# EAGLE board Sensor Acquisition Board Rev5 (EAGLE 9.6.2)
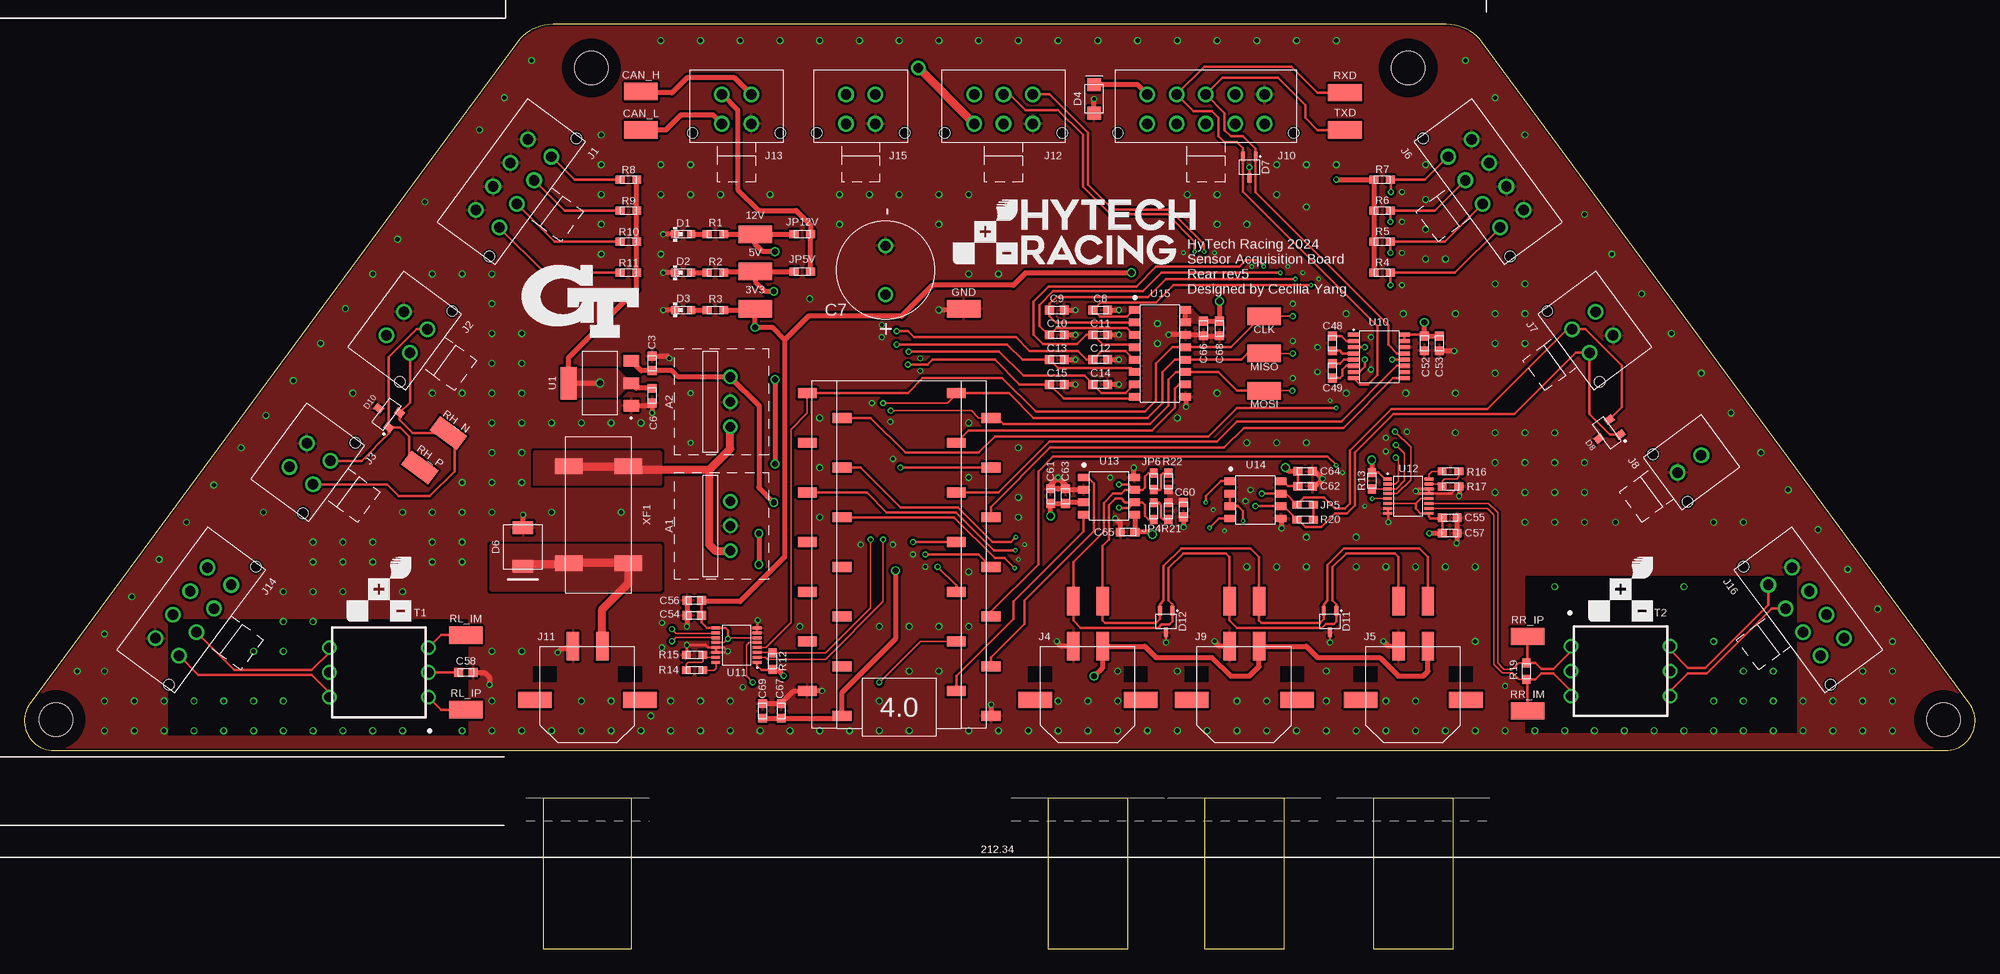
[diagram p5: board, top side]
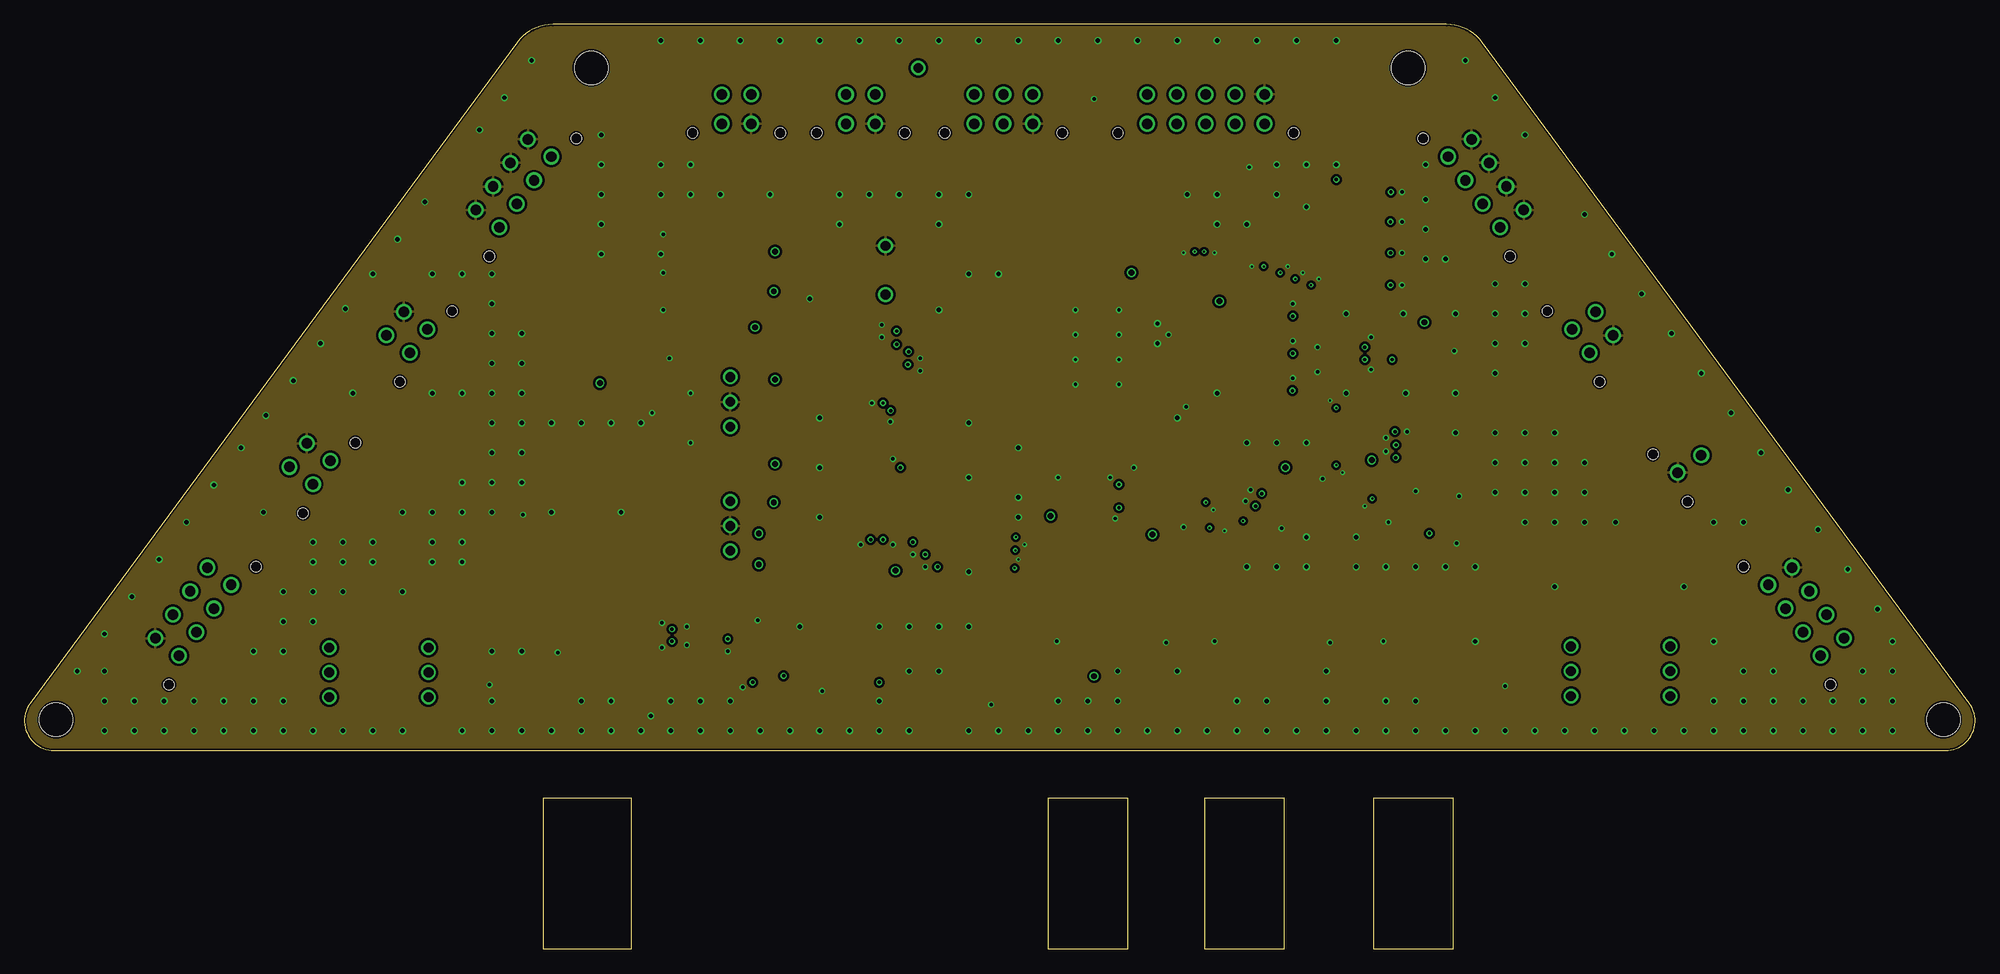
[diagram p6: board, inner layer Route2]
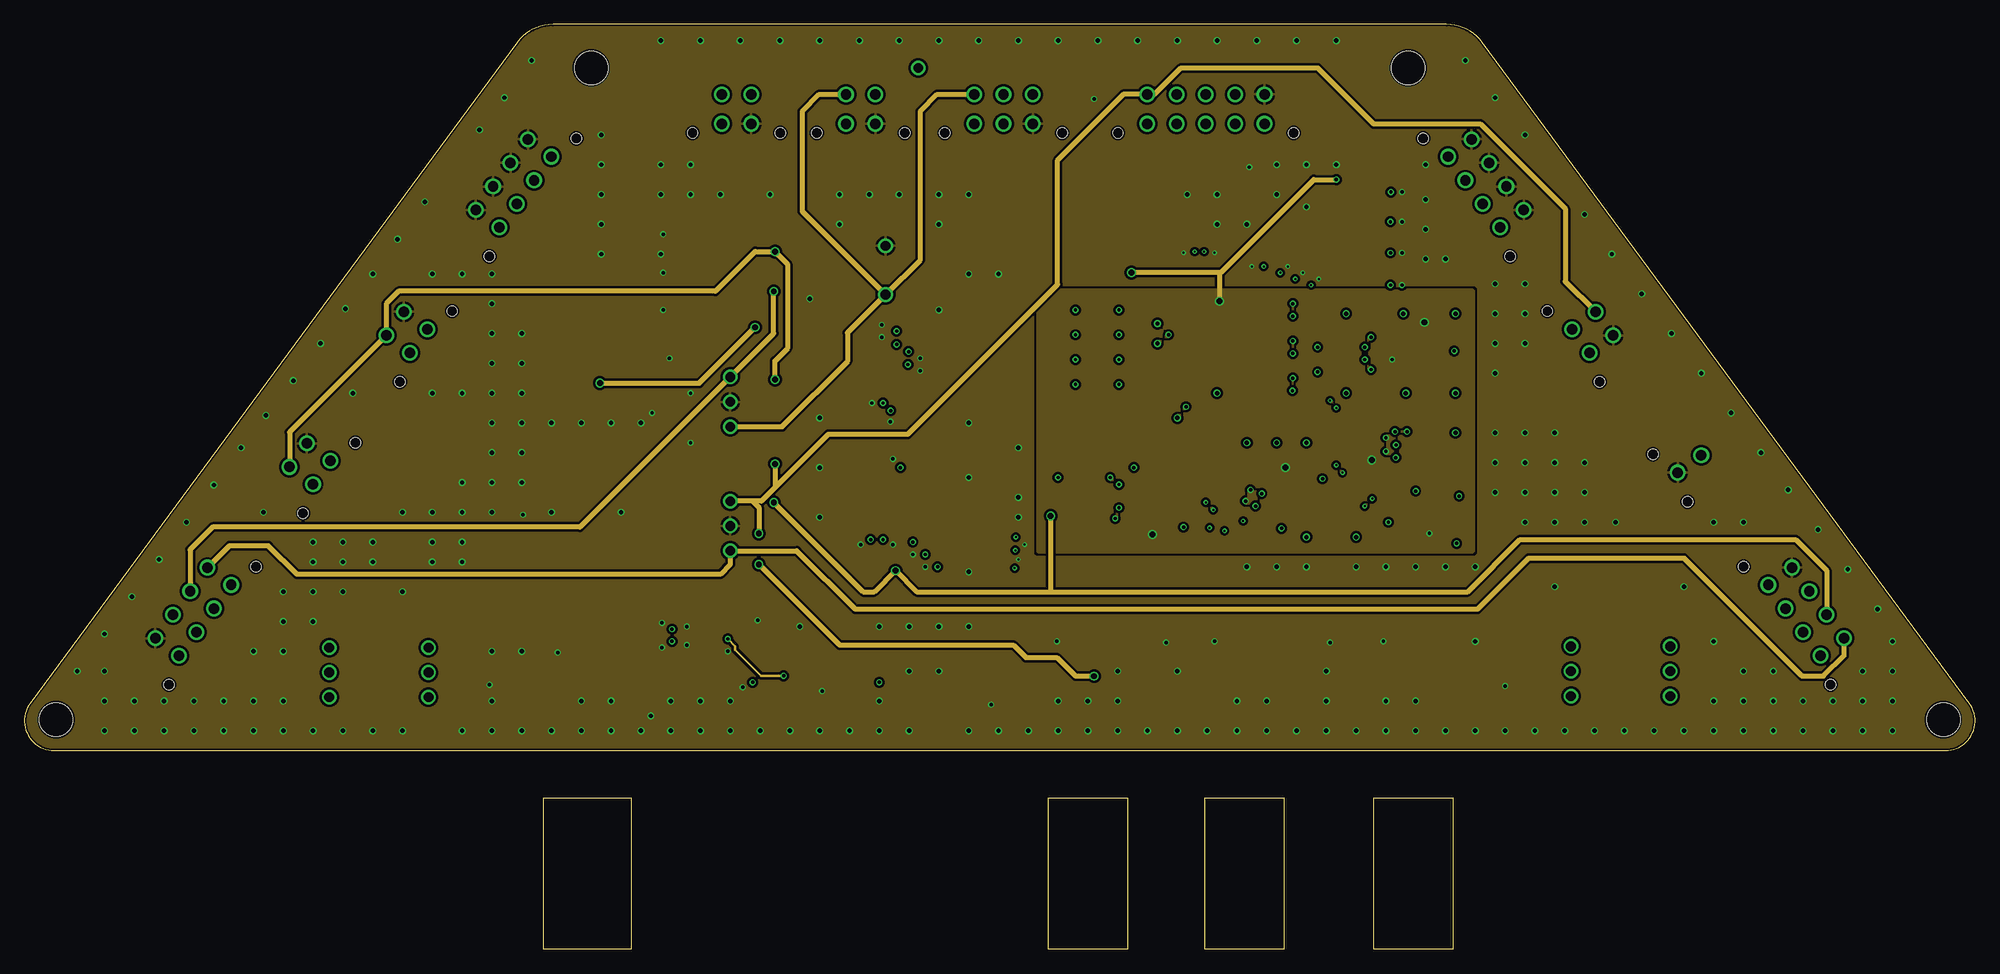
[diagram p7: board, inner layer Route15]
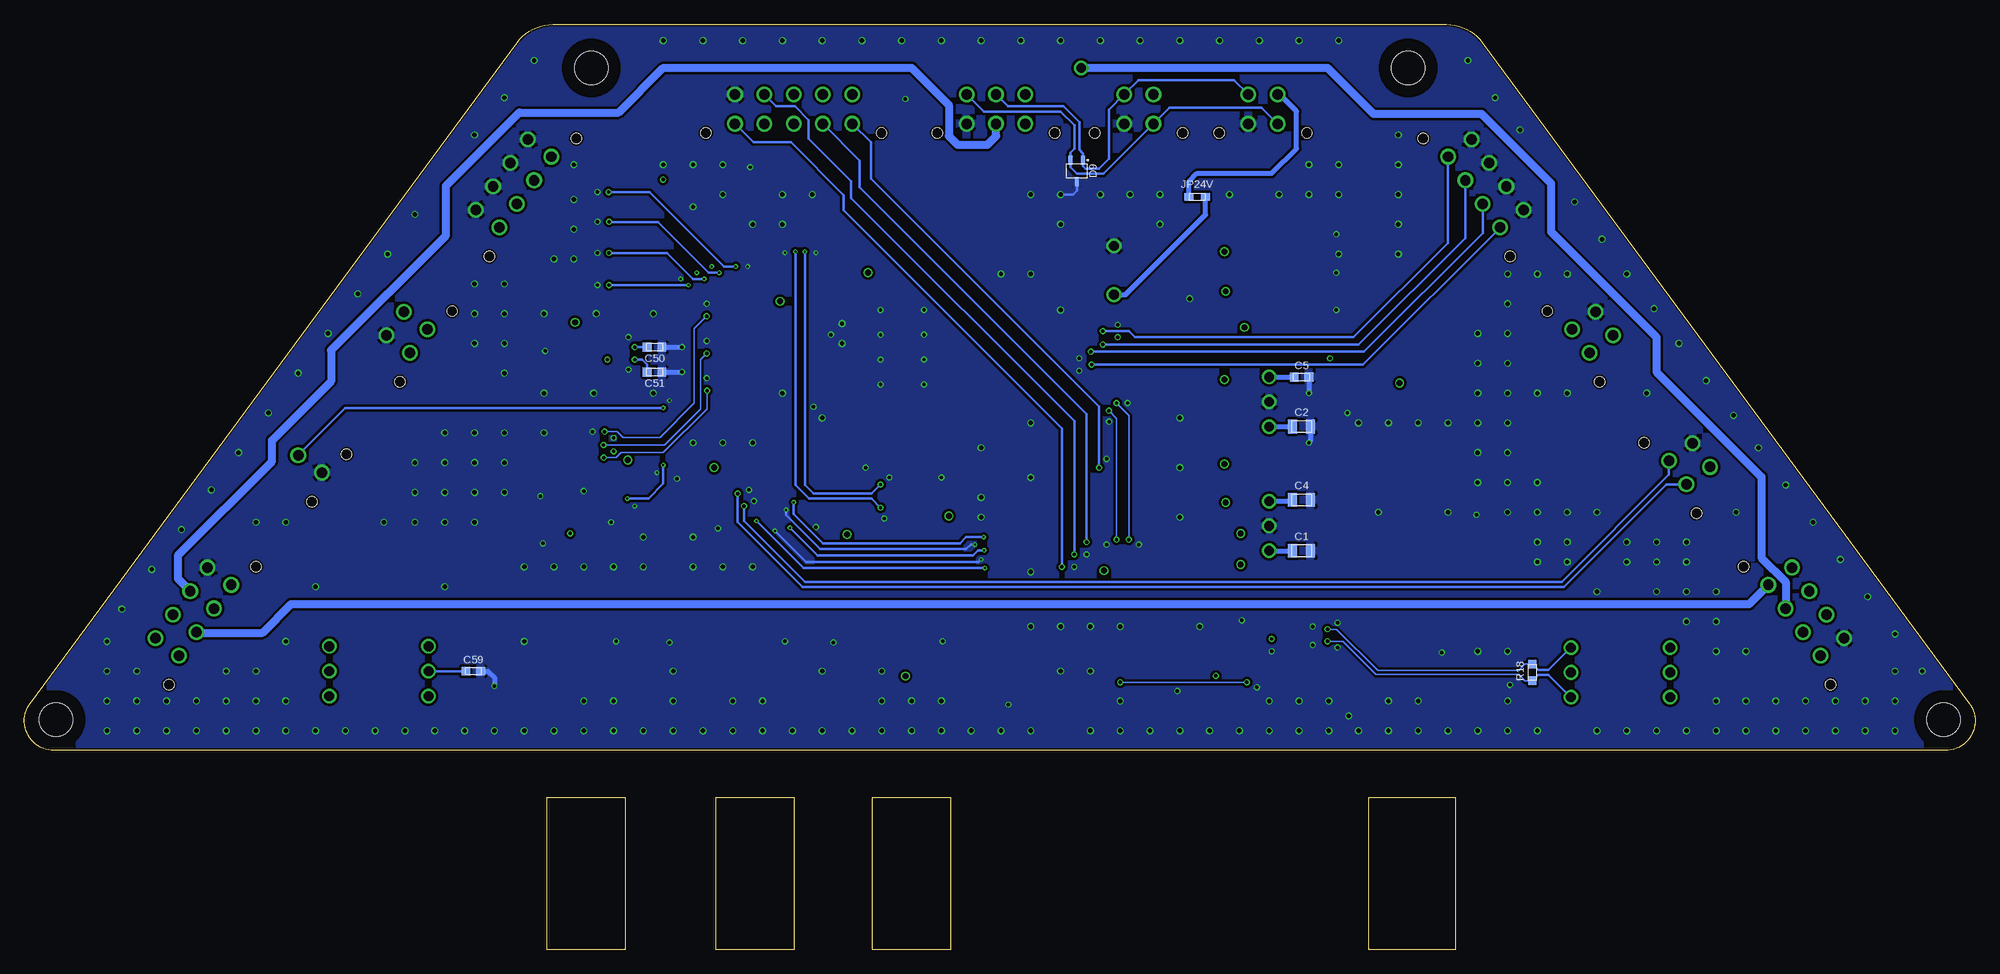
[diagram p8: board, bottom side, seen from below]

Size 199.51 x 74.3 mm. Coordinates in mm from the lower left corner, seen from the top.
Outline: 198.92,4.86 149.13,72.44 arc54 145.45,74.3 54.06,74.3 arc54 50.38,72.44 0.59,4.86 arc126 3.05,0 196.47,0 arc126 198.92,4.86
Copper layers (1+2*15+16): Top 0.035mm / dielectric 0.2mm / Route2 0.0175mm / dielectric 1.065mm / Route15 0.0175mm / dielectric 0.2mm / Bottom 0.035mm
Design rules "JLCPCB (4 Layer) *": minimum track width 5mil, minimum drill 0.2mm, track to track 10mil, track to pad 5mil, pad to pad 5mil, via to via 20mil, smd to smd 5mil, copper to edge 0.2mm, drill to drill 21mil, minimum pad ring 6mil, minimum via ring 5mil, stop-mask expansion 2mil, vias tented up to drill 30mil, thermal gap 10mil

## Footprints (pad centres in the part's own frame; a part is rotated, then mirrored left to right if it is on the bottom)
5015 = smd 3.429 x 1.778: 1 0,0
OKI-78SR = drill 0.991: 1 -2.54,0; 2 0,0; 3 2.54,0
TEENSY_SHORT_SSM = smd 1.905 x 1.02: 3.3V -5.842,-11.43; AGND/GND -9.398,-13.97; D0 5.842,-13.97; D1 9.398,-11.43; D2 5.842,-8.89; D3 9.398,-6.35; D4 5.842,-3.81; D5 9.398,-1.27; D6 5.842,1.27; D7 9.398,3.81; D8 5.842,6.35; D9 9.398,8.89; D10 5.842,11.43; D11 9.398,13.97; D12 5.842,16.51; D13 -9.398,16.51; D14 -5.842,13.97; D15 -9.398,11.43; D16 -5.842,8.89; D17 -9.398,6.35; D18 -5.842,3.81; D19 -9.398,1.27; D20 -5.842,-1.27; D21 -9.398,-3.81; D22 -5.842,-6.35; D23 -9.398,-8.89; GND 9.398,-16.51; VIN -5.842,-16.51
0805-CAP = smd 0.95 x 1.4: 1 -0.925,0; 2 0.925,0
0603-CAP = smd 0.9 x 0.9: 1 -0.75,0; 2 0.75,0
EEH-AZS = drill 1: MINUS 2.5,0; PLUS -2.5,0
0603-LED = smd 0.8 x 0.8: 1 -0.825,0; 2 0.825,0
SMF = smd 1.3 x 1.4: P$1 -1.45,0; P$2 1.45,0
1.5SMBJ = smd 1.27 x 2.1: 1 -1.98,0; 2 1.98,0
SC-70-3 = smd 0.95 x 0.4: 1 -1.1,0.65; 2 -1.1,-0.65; 3 1.1,0
SOT-23 = smd 0.711 x 0.889: 1 -0.94,-1.003; 2 0.94,-1.003; 3 0,1.003
MOLEX_MICROFIT_PTH_VERTICAL_08_DUAL = drill 1.067: 1 4.496,-2.997; 2 1.499,-2.997; 3 -1.499,-2.997; 4 -4.496,-2.997; 5 4.496,0; 6 1.499,0; 7 -1.499,0; 8 -4.496,0 | hole 1.067: 7.493,0.94; -7.493,0.94
MOLEX_MICROFIT_PTH_VERTICAL_04_DUAL = drill 1.067: 1 1.499,-2.997; 2 -1.499,-2.997; 3 1.499,0; 4 -1.499,0 | hole 1.067: 4.496,0.94; -4.496,0.94
MOLEX_MICROFIT_SMD_RIGHTANGLE_04_DUAL = smd 1.27 x 2.921: 1 1.5,5.474; 2 -1.5,5.474; 3 1.5,10.097; 4 -1.5,10.097 | smd 3.429 x 1.651: PAD1 5.386,0; PAD2 -5.386,0
MOLEX_MICROFIT_PTH_VERTICAL_02_DUAL = drill 1.067: 1 0,-2.997; 2 0,0 | hole 1.067: 2.997,0.94; -2.997,0.94
MOLEX_MICROFIT_PTH_VERTICAL_10_DUAL = drill 1.067: 1 5.994,-2.997; 2 2.997,-2.997; 3 0,-2.997; 4 -2.997,-2.997; 5 -5.994,-2.997; 6 5.994,0; 7 2.997,0; 8 0,0; 9 -2.997,0; 10 -5.994,0 | hole 1.067: 8.992,0.94; -8.992,0.94
MOLEX_MICROFIT_SMD_RIGHTANGLE_02_SINGLE = smd 1.27 x 2.921: 1 1.499,5.474; 2 -1.499,5.474 | smd 3.429 x 1.651: PAD1 5.372,0; PAD2 -5.372,0
MOLEX_MICROFIT_PTH_VERTICAL_06_DUAL = drill 1.067: 1 2.997,-2.997; 2 0,-2.997; 3 -2.997,-2.997; 4 2.997,0; 5 0,0; 6 -2.997,0 | hole 1.067: 5.994,0.94; -5.994,0.94
0603-RES = smd 0.9 x 0.8: 1 -0.85,0; 2 0.85,0
78613/3C = drill 0.991 pad 1.2: 1 -5.08,2.54; 2 -5.08,0; 3 -5.08,-2.54; 4 5.08,-2.54; 5 5.08,0; 6 5.08,2.54
SOT-223 = smd 1.2 x 1.6: 1 -2.3,-3.2; 2 0,-3.2; 3 2.3,-3.2 | smd 3.3 x 1.6: 4 0,3.2
SSOP-16 = smd 0.419 x 1.143: 1 -2.159,-2.54; 2 -1.524,-2.54; 3 -0.889,-2.54; 4 -0.254,-2.54; 5 0.381,-2.54; 6 1.016,-2.54; 7 1.651,-2.54; 8 2.286,-2.54; 9 2.286,2.667; 10 1.651,2.667; 11 1.016,2.667; 12 0.381,2.667; 13 -0.254,2.667; 14 -0.889,2.667; 15 -1.524,2.667; 16 -2.159,2.667
MSOP-16 = smd 0.305 x 0.889: 1 -1.75,-2.106; 2 -1.25,-2.106; 3 -0.75,-2.106; 4 -0.25,-2.106; 5 0.25,-2.106; 6 0.75,-2.106; 7 1.25,-2.106; 8 1.75,-2.106; 9 1.75,2.106; 10 1.25,2.106; 11 0.75,2.106; 12 0.25,2.106; 13 -0.25,2.106; 14 -0.75,2.106; 15 -1.25,2.106; 16 -1.75,2.106
SOIC-08(NARROW,0.15") = smd 0.762 x 1.143: 1 -1.905,-2.603; 2 -0.635,-2.603; 3 0.635,-2.603; 4 1.905,-2.603; 5 1.905,2.603; 6 0.635,2.603; 7 -0.635,2.603; 8 -1.905,2.603
SOIC-16 = smd 0.762 x 1.143: 1 -4.445,-2.603; 2 -3.175,-2.603; 3 -1.905,-2.603; 4 -0.635,-2.603; 5 0.635,-2.603; 6 1.905,-2.603; 7 3.175,-2.603; 8 4.445,-2.603; 9 4.445,2.603; 10 3.175,2.603; 11 1.905,2.603; 12 0.635,2.603; 13 -0.635,2.603; 14 -1.905,2.603; 15 -3.175,2.603; 16 -4.445,2.603
MOUNTING_M3 = hole 3.4: 0,0
3588 = smd 1.575 x 2.819: 1 -4.953,3.035; 2 -4.953,-3.035; 3 4.953,-3.035; 4 4.953,3.035

## Placement (x,y rotation side)
3V3  TEST_POINT  [5015]  74.74,45.21 180 top
5V  TEST_POINT  [5015]  74.74,49.02 180 top
12V  TEST_POINT  [5015]  74.74,52.83 180 top
A1  VOLTAGE_REGULATOR_MODULE_OKI-78SR_12V  [OKI-78SR]  72.2,22.99 90 top
A2  VOLTAGE_REGULATOR_MODULE_OKI-78SR_5V  [OKI-78SR]  72.2,35.69 90 top
A3  TEENSY_4.0SM  [TEENSY_SHORT_SSM]  89.47,20.07 0 top
C1  CAPACITOR_0805_50V_10UF  [0805-CAP]  68.9,20.45 0 bottom
C2  CAPACITOR_0805_50V_10UF  [0805-CAP]  68.9,33.15 0 bottom
C3  CAPACITOR_0603_25V_10UF  [0603-CAP]  64.2,39.62 90 top
C4  CAPACITOR_0805_50V_10UF  [0805-CAP]  68.9,25.65 0 bottom
C5  CAPACITOR_0603_25V_10UF  [0603-CAP]  68.9,38.23 0 bottom
C6  CAPACITOR_0603_25V_10UF  [0603-CAP]  64.2,36.32 270 top
C7  CAPACITOR_ELECTROLYTIC_EEH_AZS_470UF  [EEH-AZS]  88.07,49.15 90 top
C8  CAPACITOR_0603_10V_1UF  [0603-CAP]  110.04,45.09 0 top
C9  CAPACITOR_0603_10V_1UF  [0603-CAP]  105.6,45.09 0 top
C10  CAPACITOR_0603_10V_1UF  [0603-CAP]  105.6,42.55 0 top
C11  CAPACITOR_0603_10V_1UF  [0603-CAP]  110.04,42.55 0 top
C12  CAPACITOR_0603_10V_1UF  [0603-CAP]  110.04,40.01 0 top
C13  CAPACITOR_0603_10V_1UF  [0603-CAP]  105.6,40.01 0 top
C14  CAPACITOR_0603_10V_1UF  [0603-CAP]  110.04,37.47 0 top
C15  CAPACITOR_0603_10V_1UF  [0603-CAP]  105.6,37.47 0 top
C48  CAPACITOR_0603_35V_0.1UF  [0603-CAP]  133.79,41.66 270 top
C49  CAPACITOR_0603_35V_0.1UF  [0603-CAP]  133.79,38.86 270 top
C50  CAPACITOR_0603_35V_0.1UF  [0603-CAP]  135.06,41.27 180 bottom
C51  CAPACITOR_0603_35V_0.1UF  [0603-CAP]  135.06,38.73 180 bottom
C52  CAPACITOR_0603_35V_0.1UF  [0603-CAP]  143.19,41.66 270 top
C53  CAPACITOR_0603_35V_1UF  [0603-CAP]  144.72,41.66 270 top
C54  CAPACITOR_0603_10V_0.1UF  [0603-CAP]  68.52,13.84 180 top
C55  CAPACITOR_0603_10V_0.1UF  [0603-CAP]  145.78,23.83 0 top
C56  CAPACITOR_0603_10V_1UF  [0603-CAP]  68.52,15.37 180 top
C57  CAPACITOR_0603_10V_1UF  [0603-CAP]  145.78,22.25 0 top
C58  CAPACITOR_0603_10V_15PF  [0603-CAP]  45.15,8 0 top
C59  CAPACITOR_0603_10V_15PF  [0603-CAP]  153.61,8.13 0 bottom
C60  CAPACITOR_0603_10V_4.7NF  [0603-CAP]  118.55,24.64 270 top
C61  CAPACITOR_0603_10V_4.7UF  [0603-CAP]  104.96,26.04 90 top
C62  CAPACITOR_0603_35V_0.1UF  [0603-CAP]  131,27.05 0 top
C63  CAPACITOR_0603_10V_0.1UF  [0603-CAP]  106.49,26.04 90 top
C64  CAPACITOR_0603_35V_1UF  [0603-CAP]  131,28.57 0 top
C65  CAPACITOR_0603_10V_0.1UF  [0603-CAP]  112.84,22.35 180 top
C66  CAPACITOR_0603_10V_0.1UF  [0603-CAP]  120.59,43.18 270 top
C67  CAPACITOR_0603_10V_0.1UF  [0603-CAP]  77.41,4.06 90 top
C68  CAPACITOR_0603_10V_1UF  [0603-CAP]  122.24,43.18 270 top
C69  CAPACITOR_0603_10V_1UF  [0603-CAP]  75.5,4.06 90 top
CAN_H  TEST_POINT  [5015]  63.05,67.44 0 top
CAN_L  TEST_POINT  [5015]  63.05,63.5 0 top
CLK  TEST_POINT  [5015]  126.81,44.45 0 top
D1  LED_0603_RED  [0603-LED]  67.37,52.83 0 top
D2  LED_0603_YELLOW  [0603-LED]  67.37,48.9 0 top
D3  LED_0603_GREEN  [0603-LED]  67.37,45.09 0 top
D4  TVS_DO-219AB_14V  [SMF]  109.41,66.67 90 top
D6  TVS_DO-214AA_30V  [1.5SMBJ]  50.99,20.83 270 top
D7  TVS_BIDIRECTIONAL_DUAL  [SC-70-3]  125.28,59.69 270 top
D8  TVS_BIDIRECTIONAL_DUALRS422  [SOT-23]  161.86,32.51 126.4 top
D9  TVS_BIDIRECTIONAL_DUAL  [SC-70-3]  91.88,59.31 270 bottom
D10  TVS_BIDIRECTIONAL_DUALRS422  [SOT-23]  37.02,34.42 53.6 top
D11  TVS_BIDIRECTIONAL_DUAL  [SC-70-3]  133.54,13.21 270 top
D12  TVS_BIDIRECTIONAL_DUAL  [SC-70-3]  116.78,13.21 270 top
GND  TEST_POINT  [5015]  96.07,45.21 0 top
J1  CONNECTOR-8_μF_T_V_BLACK  [MOLEX_MICROFIT_PTH_VERTICAL_08_DUAL]  51.24,57.15 233.6 top
J2  CONNECTOR-4_μF_T_V_BLACK  [MOLEX_MICROFIT_PTH_VERTICAL_04_DUAL]  40.32,41.91 233.6 top
J3  CONNECTOR-4_μF_T_V_BLACK  [MOLEX_MICROFIT_PTH_VERTICAL_04_DUAL]  30.42,28.45 233.6 top
J4  CONNECTOR-4_μF_S_RA_  [MOLEX_MICROFIT_SMD_RIGHTANGLE_04_DUAL]  108.77,5.21 0 top
J5  CONNECTOR-4_μF_S_RA_  [MOLEX_MICROFIT_SMD_RIGHTANGLE_04_DUAL]  142.05,5.21 0 top
J6  CONNECTOR-8_μF_T_V_BLACK  [MOLEX_MICROFIT_PTH_VERTICAL_08_DUAL]  148.27,57.15 126.4 top
J7  CONNECTOR-4_μF_T_V_BLACK  [MOLEX_MICROFIT_PTH_VERTICAL_04_DUAL]  159.19,41.91 126.4 top
J8  CONNECTOR-2_μF_T_V_BLACK  [MOLEX_MICROFIT_PTH_VERTICAL_02_DUAL]  169.1,28.45 126.4 top
J9  CONNECTOR-4_μF_S_RA_  [MOLEX_MICROFIT_SMD_RIGHTANGLE_04_DUAL]  124.78,5.21 0 top
J10  CONNECTOR-10_MF_T_V_  [MOLEX_MICROFIT_PTH_VERTICAL_10_DUAL]  120.84,64.14 180 top
J11  CONNECTOR-2_MICROFIT_SMD_RIGHTANGLE_02_SINGLE_BLACK  [MOLEX_MICROFIT_SMD_RIGHTANGLE_02_SINGLE]  57.59,5.21 0 top
J12  CONNECTOR-6_μF_T_V_BLACK  [MOLEX_MICROFIT_PTH_VERTICAL_06_DUAL]  100.14,64.14 180 top
J13  CONNECTOR-4_μF_T_V_BLACK  [MOLEX_MICROFIT_PTH_VERTICAL_04_DUAL]  72.83,64.14 180 top
J14  CONNECTOR-8_μF_T_V_BLACK  [MOLEX_MICROFIT_PTH_VERTICAL_08_DUAL]  18.48,13.34 233.6 top
J15  CONNECTOR-4_μF_T_V_BLACK  [MOLEX_MICROFIT_PTH_VERTICAL_04_DUAL]  85.53,64.14 180 top
J16  CONNECTOR-8_μF_T_V_BLACK  [MOLEX_MICROFIT_PTH_VERTICAL_08_DUAL]  181.04,13.34 126.4 top
JP4  JUMPER_0603_  [0603-RES]  115.51,24.51 90 top
JP5  JUMPER_0603_  [0603-RES]  131,25.15 180 top
JP5V  JUMPER_0603_  [0603-RES]  79.56,49.02 180 top
JP6  JUMPER_0603_  [0603-RES]  115.51,27.56 90 top
JP12V  JUMPER_0603_  [0603-RES]  79.56,52.83 180 top
JP24V  JUMPER_0603_  [0603-RES]  79.56,56.64 0 bottom
MISO  TEST_POINT  [5015]  126.81,40.64 0 top
MOSI  TEST_POINT  [5015]  126.81,36.83 0 top
R1  RESISTOR_0603_1K  [0603-RES]  70.67,52.83 180 top
R2  RESISTOR_0603_240  [0603-RES]  70.67,48.9 180 top
R3  RESISTOR_0603_120  [0603-RES]  70.67,45.09 180 top
R4  RESISTOR_0603_8.35K  [0603-RES]  138.87,48.9 0 top
R5  RESISTOR_0603_8.35K  [0603-RES]  138.87,52.07 0 top
R6  RESISTOR_0603_8.35K  [0603-RES]  138.87,55.24 0 top
R7  RESISTOR_0603_8.35K  [0603-RES]  138.87,58.42 0 top
R8  RESISTOR_0603_8.35K  [0603-RES]  61.78,58.42 180 top
R9  RESISTOR_0603_8.35K  [0603-RES]  61.78,55.24 180 top
R10  RESISTOR_0603_8.35K  [0603-RES]  61.78,52.07 180 top
R11  RESISTOR_0603_8.35K  [0603-RES]  61.78,48.9 180 top
R12  RESISTOR_0603_2K  [0603-RES]  76.52,9.14 270 top
R13  RESISTOR_0603_2K  [0603-RES]  137.81,27.61 90 top
R14  RESISTOR_0603_1.33K  [0603-RES]  68.54,8.23 0 top
R15  RESISTOR_0603_1.13K  [0603-RES]  68.54,9.78 0 top
R16  RESISTOR_0603_1.33K  [0603-RES]  145.86,28.57 180 top
R17  RESISTOR_0603_1.13K  [0603-RES]  145.86,27.03 180 top
R18  RESISTOR_0603_120  [0603-RES]  45.27,8 270 bottom
R19  RESISTOR_0603_120  [0603-RES]  153.61,8.13 90 top
R20  RESISTOR_0603_120  [0603-RES]  131,23.62 0 top
R21  RESISTOR_0603_60.4  [0603-RES]  117.03,24.51 90 top
R22  RESISTOR_0603_60.4  [0603-RES]  117.03,27.56 90 top
RH_N  TEST_POINT  [5015]  43.37,32.51 143.6 top
RH_P  TEST_POINT  [5015]  40.45,28.96 143.6 top
RL_IM  TEST_POINT  [5015]  45.15,11.81 0 top
RL_IP  TEST_POINT  [5015]  45.15,4.19 0 top
RR_IM  TEST_POINT  [5015]  153.73,4.06 0 top
RR_IP  TEST_POINT  [5015]  153.73,11.68 0 top
RXD  TEST_POINT  [5015]  135.06,67.31 180 top
T1  78613/3C_78613/3C  [78613/3C]  36.26,8 180 top
T2  78613/3C_78613/3C  [78613/3C]  163.26,8.13 0 top
TXD  TEST_POINT  [5015]  135.06,63.5 180 top
U1  VOLTAGE_REGULATOR_SOT-223_3.3V  [SOT-223]  58.86,37.59 90 top
U10  MAX3227  [SSOP-16]  138.49,40.39 270 top
U11  LTC6820  [MSOP-16]  72.83,10.79 90 top
U12  LTC6820  [MSOP-16]  141.54,26.04 270 top
U13  TCAN1051HQV-Q1  [SOIC-08(NARROW,0.15")]  110.93,26.04 270 top
U14  MAX3075  [SOIC-08(NARROW,0.15")]  125.92,25.65 270 top
U15  MCP3208  [SOIC-16]  116.14,40.64 270 top
U$1  [LOGO_HYTECH_MEDIUM]  94.93,49.78 0 top
U$2  [LOGO_GT_MEDIUM]  56.83,45.97 0 top
U$3  [MOUNTING_M3]  141.54,69.85 0 top
U$4  [MOUNTING_M3]  57.97,69.85 0 top
U$5  [MOUNTING_M3]  196.28,3.17 0 top
U$6  [MOUNTING_M3]  3.24,3.17 0 top
U$7  [LOGO_HYTECH_SQUARE_LARGE]  36.26,16.51 0 top
U$8  [LOGO_HYTECH_SQUARE_LARGE]  163.26,16.51 0 top
XF1  FUSE_HOLDER_MINIBLADESMD  [3588]  58.74,24.13 90 top

## Tracks (layer width: path | path; a pad name or v marks a point on that pad's centre or on a via)
24VIN
  Top 0.813: J11.1 59.09,14.45 61.77,17.13 XF1.2 XF1.1 55.57,19.05 51.19,19.05 D6.2
  pour Top (no thermals): 47.81,20.95 64.96,20.95 64.96,16.51 47.81,16.51
!ADC1_CS  (via drill 0.35)
  Top 0.152: v74.48,6.99 73.85,7.62 73.85,10.79 74.1,11.04 U11.5 | A3.D2 91.63,11.18 v87.44,6.99
  Bottom 0.152: v74.48,6.99 v87.44,6.99
!ADC2_CS  (via drill 0.2)
  Top 0.152: U12.5 v137.86,25.79 v137.86,25.78
  Top 0.254: v134.17,29.21 133.29,30.1 105.22,30.1 103.69,28.57 103.69,19.05 98.87,14.22 A3.D3
  Bottom 0.254: v137.86,25.78 135.7,25.78 134.17,27.3 v134.17,29.21
!ADC3_CS
  Top 0.254: U15.10 118.11,37.47 117.66,37.02 117.66,35.1 115.33,32.77 97.34,32.77 96.58,32.77 A3.D10
+3V3  (via drill 0.35, 0.6)
  Top 0.152: U11.12 71.56,11.04 v71.94,11.43 | U11.6 72.06,11.54 | U12.6 142.31,25.29 142.81,25.79 U12.12
  Top 0.254: U13.5 113.59,24.08 | U10.15 U10.16 143.08,42.55 C52.1 | 143.95,42.42 C52.1 | C52.1 | R13.2 138.48,28.46 139.16,27.79 U12.1 | 72.06,11.54 v71.94,11.43 71.94,12.32 71.72,12.54 U11.9 69.81,12.54 69.27,13.09 C54.1 69.27,15.24 C56.1 | 74.61,45.09 3V3.1 | U14.8 128.71,27.56 129.22,27.05 C62.1 | 130.25,28.39 C64.1 C62.1 | 130.25,27.24 C62.1 | C57.1 C55.1 144.96,23.75 143.83,23.75 143.65,23.93 U12.9 143.63,24.27 142.8,24.27 142.31,24.75 142.31,25.29 | R12.2 76.48,8.26 75.37,8.26 74.94,8.69 U11.1 | U10.12 v139.89,40.01
  Top 0.508: 113.59,24.08 C65.1 115.12,22.35 v115.38,22.1 | C6.1 62.58,37.07 U1.2 | C53.1 C52.1 v143.19,43.81 | v58.86,37.59 U1.4 55.66,40.23 62.63,47.2 R11.1 R10.1 R9.1 R8.1 | 137.73,28.54 R13.2 v137.81,29.72 | R3.1 74.61,45.09 | 120.47,43.81 C66.1 C68.1 v122.24,45.97 | U15.15 U15.16 | v113.22,48.9 102.42,48.9 101.15,47.62 92.9,47.62 89.72,44.45 80.2,44.45 77.77,42.02 | 77.77,42.02 77.77,19.79 73.21,15.24 69.27,15.24 | 3V3.1 v74.74,43.31 76.48,43.31 77.77,42.02 | C64.1 129.35,28.57 v128.97,28.96 | C57.1 145.01,22.23 v143.7,22.23 | v134.17,58.42 R7.1 R6.1 R5.1 R4.1 | R12.2 77.02,8.29 v77.66,7.66
  Route15 0.254: v71.94,11.43 72.71,10.67 72.71,10.29 75.33,7.66 v77.66,7.66
  Route15 0.508: v58.86,37.59 69.02,37.59 v74.74,43.31 | v134.17,58.42 131.89,58.42 122.36,48.9 122.24,48.9 | 122.24,48.9 v113.22,48.9 | 122.24,48.9 v122.24,45.97
  pour Top (isolate 0.254, no thermals): 55.43,38.86 60.51,38.86 61.78,37.59 60.51,36.32 55.43,36.32
  pour Top (no thermals): 120.71,43.81 118.68,43.81 118.68,45.09 119.44,45.09
  pour Route15: 103.69,20.45 148.14,20.45 148.14,46.99 103.69,46.99
+5V  (via drill 0.6)
  Top 0.254: 106.6,25.4 C63.1 | R2.1 71.65,49.02
  Top 0.508: U1.3 63.08,38.87 C3.1 66.22,38.87 66.86,38.23 A2.3 75.12,35.31 75.12,26.92 v76.64,25.4 | U13.3 106.6,25.4 | C69.1 C67.1 83.39,3.31 A3.VIN 83.63,5.97 89.09,11.43 v89.09,18.41 | v104.96,24.02 C61.1 C63.1 | 5V.1 JP5V.2 | 71.65,49.02 5V.1 | 5V.1 74.74,48.01 75.75,46.99 v76.64,46.99
  Route15 0.508: v76.64,25.4 85.79,16.26 86.93,16.26 v89.09,18.41 91.25,16.26 104.96,16.26 | 104.96,16.26 147.64,16.26 152.96,21.58 181.17,21.58 184.34,18.41 J16.3 | v76.64,46.99 76.64,42.67 A2.3 56.83,22.86 19.24,22.86 16.95,20.57 J14.3 | v104.96,24.02 104.96,16.26
  Bottom 0.508: A2.3 C5.1
+12V  (via drill 0.6)
  Top 0.508: 12V.1 JP12V.2 | v75.12,22.23 v75.12,19.05 | v109.41,7.62 110.27,8.48 J4.1 114.6,10.68 115.76,9.53 121.47,9.53 123.38,7.62 125.28,7.62 126.28,8.61 J9.1 131.11,10.68 132.27,9.53 138.62,9.53 140.52,7.62 143.06,7.62 143.57,8.13 143.57,10.66 J5.1 | J10.1 113.85,68.12 D4.P$2 | R1.1 12V.1 | v76.77,51.05 75.5,51.05 74.74,51.82 12V.1 | v76.77,37.97 v76.77,29.34
  Route15 0.508: 76.77,26.92 75.37,25.53 74.48,25.53 | 74.48,25.53 A1.3 | v76.77,37.97 76.77,39.88 78.04,41.15 78.04,49.78 v76.77,51.05 74.74,51.05 70.67,46.99 38.29,46.99 37.02,45.72 J2.1 27.11,32.58 J3.1 | 74.48,25.53 75.12,24.89 v75.12,22.23 | v75.12,19.05 83.37,10.79 101.15,10.79 102.42,9.53 105.6,9.53 107.5,7.62 v109.41,7.62 | J7.1 157.61,48.01 157.61,55.44 148.91,64.14 137.98,64.14 132.27,69.85 118.3,69.85 115.58,67.13 J10.1 112.41,67.13 105.66,60.39 105.66,47.69 90.36,32.38 82.23,32.38 76.77,26.92 | v76.77,29.34 76.77,26.92
  Bottom 0.508: A1.3 69.95,25.53 C4.1
+24V
  Top 0.508: XF1.3 62.15,28.7
  Top 0.813: XF1.4 XF1.3 | 70.04,28.7 62.15,28.7 | 70.04,28.7 72.2,30.86 A2.1 | A1.1 70.67,20.45 70.04,21.08 70.04,28.7
  Route15 0.508: A2.1 77.51,33.15 84.19,39.83 84.19,42.76 C7.PLUS | C7.PLUS 79.56,55.16 79.56,65.41 81.29,67.13 J15.1 | C7.PLUS 91.63,50.2 91.63,65.41 93.36,67.13 J12.1 | J14.4 20.96,20.95 24.95,20.95 27.88,18.03 71.18,18.03 72.2,19.05 A1.1 78.99,20.45 84.96,14.48 148.65,14.48 153.86,19.68 169.73,19.68 181.8,7.62 184,7.62 186.12,9.74 J16.4
  Bottom 0.508: A1.1 C1.1 | A2.1 C2.1 | C7.PLUS 86.89,46.65 78.71,54.83 JP24V.2
  pour Top (no thermals): 52.26,30.48 64.96,30.48 64.96,27.3 52.26,27.3
CAN_N  (via drill 0.2, 0.35)
  Top 0.254: U13.6 114.36,25.4 114.62,25.15 114.62,24 114.96,23.66 JP4.1 | J5.3 143.55,19.81 142.66,20.7 134.98,20.7 133.29,19.01 133.29,15.37 132.89,14.97 D11.2 132.9,14.29 132.9,13.46 132.52,13.08 126.53,13.08 126.28,13.34 J9.3 126.28,19.81 125.39,20.7 118.34,20.7 116.52,18.88 116.52,15.37 116.13,14.97 D12.2 116.13,13.45 115.76,13.08 110.53,13.08 110.27,13.34 J4.3 110.27,20.93 110.93,21.59 110.93,25.15 111.57,25.78 112.2,25.78 112.58,25.4 U13.6 | v120.66,51.05 120.66,51.83 117.11,55.37 111.31,55.37 108.77,57.91 108.77,63.2 104.84,67.13 J12.3 | v111.95,24.84 112.98,24.84 U13.6
  Top 0.508: J13.3 70.45,65.02 67.12,65.02 65.59,63.5 CAN_L.1
  Bottom 0.254: J12.3 101.38,65.38 93.53,65.38 92.14,63.98 92.14,61.59 92.53,61.2 D9.2 92.53,59.7 91.86,59.03 89.14,59.03 J15.3 82.38,65.79 72.99,65.79 J13.3 | v120.66,51.05 120.66,27.17 119.27,25.78 112.89,25.78 v111.95,24.84
CAN_P  (via drill 0.2, 0.35)
  Top 0.254: J5.4 140.55,19.81 140.17,20.19 135.19,20.19 133.79,18.8 133.79,15.37 134.19,14.97 D11.1 134.19,13.22 133.92,12.95 133.11,12.95 132.73,12.57 124.04,12.57 123.28,13.34 J9.4 123.28,19.81 122.9,20.19 118.55,20.19 117.03,18.67 117.03,15.37 117.43,14.97 D12.1 117.43,13.22 117.11,12.91 116.31,12.91 115.97,12.57 108.04,12.57 107.27,13.34 J4.4 107.27,19.3 107.29,19.3 110.43,22.44 110.43,25.36 111.36,26.29 112.2,26.29 112.58,26.67 U13.7 | v119.7,51.05 119.7,52.07 116.9,54.86 111.1,54.86 108.27,57.7 108.27,62.99 105.73,65.53 102.37,65.53 100.77,67.13 J12.2 | JP6.2 114.96,28.41 114.62,28.07 114.62,26.92 114.36,26.67 U13.7 | v111.95,27.23 112.98,27.23 U13.7
  Top 0.508: J13.2 72.63,68.83 67.75,68.83 66.23,67.31 63.18,67.31 CAN_H.1
  Bottom 0.254: J12.2 98.92,65.91 93.24,65.91 91.6,64.28 91.6,61.47 91.23,61.1 D9.1 91.25,60.39 91.25,59.82 90.99,59.56 89.62,59.56 88.61,60.58 88.61,65.56 J15.2 85.58,68.58 75.78,68.58 J13.2 | v119.7,51.05 119.7,27.18 118.81,26.29 112.89,26.29 v111.95,27.23
EN_485  (via drill 0.2)
  Top 0.254: U14.2 U14.3 124.14,25.02 124.65,24.51 v124.65,23.5 | A3.D18 95.06,23.88 99.25,19.68 100.27,19.68 v101.28,18.67
  Bottom 0.254: v101.28,18.67 119.82,18.67 v124.65,23.5
GND  (via drill 0.2, 0.35, 0.45)
  Top 0.254: 106.6,26.67 C63.2 | U12.7 U12.8 139.51,24.21 v139.51,23.37 | 67.75,9.78 R15.1 67.75,9.84 v67.75,10.79 69.66,10.79 69.91,10.54 U11.13 | R17.1 145.98,26.29 U12.13 U12.14 142.54,26.79 v142.3,26.54 142.56,26.29 U12.13 | U11.13 U11.14 71.83,10.04 v71.94,10.16 71.56,10.54 U11.13 | 67.77,12.71 v67.75,12.7 | v74.99,13.34 74.99,12.6 U11.8 U11.7 | D12.3 v116.78,11.05 | D11.3 v133.54,11.05 | D7.3 v125.28,59.69
  Top 0.508: C60.2 v118.55,22.86 | C6.2 | 55.98,10.79 J11.2 55.83,10.41 54.93,10.41 v54.55,10.03 | v81.6,6.1 A3.AGND/GND 78.69,6.1 C67.2 C69.2 | C58.2 47.05,8 47.56,7.49 v47.56,6.73 | 67.77,12.71 C54.2 C56.2 | D1.1 v65.34,52.83 | D2.1 v65.34,48.9 | D3.1 v65.34,45.09 | C3.2 65.73,40.37 v65.98,40.13 | C6.2 v64.2,34.54 | v111.57,23.75 112.09,23.23 C65.2 | U13.8 113.47,28 v113.47,28.96 | U13.2 106.6,26.67 | v98.87,4.7 A3.GND | C68.2 C66.2 120.47,42.55 U15.14 v117.03,42.55 | U15.9 118.81,36.13 v118.81,35.18 | U14.5 128.59,23.69 v128.59,22.73 | R17.1 146.75,26.99 v146.75,26.04 | v146.49,21.21 146.49,22.21 C57.2 C55.2 | J4.2 106.09,10.68 v105.6,11.18 | J9.2 122.22,10.68 v121.73,11.18 | J5.2 139.5,10.68 v139,11.18 | D6.1 v50.99,24.13 | C9.2 v107.5,45.09 | C10.2 v107.5,42.55 | C13.2 v107.5,40.01 | v107.5,37.47 C15.2 | C11.2 v111.95,42.55 | C8.2 v111.95,45.09 | v111.95,37.47 C14.2 | U1.1 63.92,35.29 C6.2 | C53.2 146.23,40.91 v146.24,40.89 | C64.2 132.02,28.57 v132.78,27.81 132.02,27.05 C62.2 | C12.2 v111.95,40.01 | GND.1 95.95,45.09 v93.53,45.09 | D4.P$1 v109.41,66.67 | C63.2 C61.2 104.96,27.18 v105.73,27.94 106.49,27.18 C63.2
  Bottom 0.254: v102.3,21.08 102.72,21.08 103.18,20.62 118.14,20.62 121.6,24.08 v121.6,24.64 | v101.66,19.56 101.92,19.3 119.57,19.3 v122.74,22.48 | D9.3 91.88,57.28 92.26,56.9 v93.53,56.9
  Bottom 0.508: C50.1 v132.27,41.27 | C51.1 v132.27,38.73 | C59.2 152.09,8.13 151.45,7.48 v151.45,6.6 | C5.2 68.15,36.59 v68.13,36.58 | C2.2 67.97,31.66 v68.13,31.5
  other vias: 118.55,50.93 121.73,50.93 65.09,72.64 69.15,72.64 73.21,72.64 77.28,72.64 81.34,72.64 85.41,72.64 89.47,72.64 93.53,72.64 97.6,72.64 101.66,72.64 105.73,72.64 109.79,72.64 113.85,72.64 117.92,72.64 121.98,72.64 130.11,72.64 126.05,72.64 134.17,72.64 65.21,10.54 65.21,13.08 133.54,35.81 73.47,6.48 85.53,21.08 88.84,21.08 92.14,18.8 90.87,20.07 88.84,29.84 86.68,35.56 88.58,33.66 129.22,49.53 132.4,48.26 130.75,48.9 125.54,49.53 140.91,47.62 140.91,50.93 140.91,54.1 140.91,57.15 129.73,45.72 129.73,41.91 129.73,38.1 137.73,42.29 137.73,38.99 141.41,32.64 139.25,32 139.25,30.61 137.1,25.02 134.81,28.45 125.41,26.67 124.9,25.53 111.06,27.94 51.88,70.61 49.08,66.8 40.96,56.13 27.49,37.85 16.57,23.37 5.4,8.13 8.19,8.13 8.19,5.08 11.24,5.08 32.83,45.21 38.16,52.32 30.29,41.66 24.7,34.29 19.37,27.18 46.54,63.5 35.62,48.77 22.16,30.99 10.98,15.75 147.38,70.61 150.43,66.8 153.48,62.99 159.57,54.86 162.37,50.8 165.42,46.74 168.46,42.67 171.51,38.61 174.56,34.54 177.61,30.48 180.4,26.67 191.07,11.18 188.02,8.13 191.07,8.13 188.02,5.08 191.07,5.08 184.97,5.08 181.93,5.08 11.24,2.03 14.29,5.08 8.19,2.03 14.29,2.03 23.43,10.16 178.88,8.13 178.88,5.08 175.83,5.08 175.83,8.13 172.78,5.08 172.78,11.18 169.73,16.76 156.53,16.76 156.53,23.37 159.57,23.37 159.57,26.42 156.53,26.42 159.57,29.46 156.53,29.46 156.53,32.51 153.48,32.51 153.48,29.46 153.48,26.42 153.48,23.37 150.43,41.66 150.43,44.7 150.43,47.75 153.48,47.75 153.48,44.7 146.37,44.7 146.37,36.58 146.37,32.51 128.08,31.5 131.13,31.5 121.98,36.58 117.92,34.04 136.21,21.84 131.13,21.84 128.08,18.8 131.13,18.8 136.21,18.8 139.25,18.8 142.3,18.8 141.03,44.7 135.19,44.7 141.29,36.58 143.32,50.29 143.32,53.34 143.32,56.39 143.32,59.94 128.08,59.94 131.13,55.63 121.98,56.9 118.93,56.9 89.47,56.9 96.58,48.77 86.42,56.9 83.37,56.9 80.33,46.23 71.18,56.9 68.13,56.9 68.13,59.94 58.99,59.94 58.99,56.9 58.99,53.85 58.99,50.8 47.81,48.77 47.81,42.67 50.86,42.67 47.81,39.62 47.81,36.58 50.86,39.62 47.81,33.53 50.86,33.53 47.81,27.43 47.81,24.38 44.77,27.43 44.77,24.38 44.77,21.34 41.72,21.34 29.53,21.34 32.57,21.34 69.15,5.08 96.58,27.94 72.2,5.08 66.1,5.08 124.01,5.08 117.92,8.13 139.25,5.08 142.3,5.08 127.06,5.08 172.78,23.37 148.4,11.18 111.82,5.08 108.77,5.08 111.82,8.13 60.01,5.08 56.96,5.08 47.81,5.08 64.07,3.56 8.19,11.94 13.78,19.56 101.66,23.88 101.66,25.91 101.66,30.99 81.34,34.04 81.34,28.96 81.34,23.88 87.44,12.7 93.53,12.7 93.53,8.13 90.49,8.13 87.44,5.08 79.31,12.7 17.33,2.03 17.33,5.08 20.38,5.08 20.38,2.03 23.43,2.03 23.43,5.08 26.48,5.08 26.48,2.03 29.53,2.03 26.48,10.16 26.48,13.21 29.53,13.21 29.53,16.26 26.48,16.26 29.53,19.3 32.57,19.3 32.57,16.26 35.62,19.3 35.62,21.34 38.67,16.26 41.72,19.3 44.77,19.3 41.72,24.38 38.67,24.38 32.57,2.03 35.62,2.03 38.67,2.03 44.77,2.03 47.81,2.03 50.86,2.03 53.91,2.03 56.96,2.03 60.01,2.03 63.05,2.03 66.1,2.03 69.15,2.03 72.2,2.03 75.25,2.03 78.29,2.03 81.34,2.03 84.39,2.03 87.44,2.03 90.49,2.03 96.58,2.03 99.63,2.03 102.68,2.03 105.73,5.08 108.77,2.03 111.82,2.03 114.87,2.03 117.92,2.03 120.97,2.03 124.01,2.03 127.06,2.03 130.11,2.03 133.16,2.03 136.21,2.03 139.25,2.03 142.3,2.03 145.35,2.03 148.4,2.03 151.45,2.03 154.49,2.03 157.54,2.03 160.59,2.03 163.64,2.03 166.69,2.03 169.73,2.03 172.78,2.03 175.83,2.03 178.88,2.03 181.93,2.03 184.97,2.03 188.02,2.03 191.07,2.03 47.81,30.48 50.86,30.48 50.86,27.43 53.91,24.38 50.86,36.58 44.77,36.58 41.72,36.58 47.81,45.72 53.91,33.53 61.02,24.38 33.59,36.58 24.45,24.38 44.77,48.77 41.72,48.77 58.99,62.99 65.09,59.94 65.09,56.9 65.09,50.8 76.26,56.9 83.37,53.85 93.53,53.85 96.58,56.9 99.63,48.77 121.98,53.85 125.03,53.85 128.08,56.9 131.13,59.94 134.17,59.94 145.35,50.29 56.96,33.53 60.01,33.53 63.05,33.53 47.81,10.16 50.86,10.16 90.49,12.7 96.58,33.53 96.58,18.29 96.58,12.7 133.16,8.13 105.73,2.03 133.16,5.08 145.35,18.8 148.4,18.8 125.03,18.8 115.89,43.69 115.89,41.66 183.45,22.61 186.5,18.54 189.55,14.48 150.43,32.51 150.43,29.46 150.43,26.42 150.43,38.61 153.48,41.66 135.19,36.58 125.03,31.5 162.75,23.37 175.83,23.37 87.69,43.56 87.69,42.29 91.63,40.13 91.63,38.86
  pour Route2 (rank 2): -7.94,-1.27 49.21,76.2 150.18,76.2 207.85,-2.16 -8.53,-2.16
  pour Bottom: -14.42,-5.71 214.18,-5.71 151.95,78.11 47.81,78.11
  pour Top (rank 2): -4.89,-0.64 50.99,74.93 148.14,74.93 204.02,-0.64
  cutout Top: 14.79,13.34 45.27,13.34 45.27,1.65 14.79,1.65
  cutout Top: 153.61,17.78 181.16,17.78 181.16,1.91 153.61,1.91
  pour Route15 (rank 2): 48.45,77.47 -11.88,-3.81 211.64,-3.81 151.32,77.47
GPS_PPS  (via drill 0.35)
  Top 0.254: A3.D4 95.31,16.89 v93.41,18.8
  Bottom 0.254: J10.10 124.93,62.23 121.12,62.23 115.73,56.84 115.73,55.3 93.41,32.98 v93.41,18.8
N$1  (via drill 0.35)
  Top 0.254: U10.3 v137.1,41.27
  Bottom 0.254: v137.1,41.27 C50.2
N$2
  Top 0.254: U10.2 135.19,41.91 134.68,42.42 C48.1
N$3  (via drill 0.35)
  Top 0.254: U10.7 136.55,38.73 137.1,39.29 v137.1,40.01
  Bottom 0.254: C51.2 135.81,39.48 136.33,40.01 v137.1,40.01
N$4
  Top 0.254: JP5.1 R20.2
N$5
  Top 0.508: JP5V.1 JP12V.1 80.41,53.76 78.93,55.24 75.12,55.24 72.96,57.4 72.96,65.51 J13.1
  Bottom 0.508: JP24V.1 80.41,58.2 79.56,59.05 71.94,59.05 69.4,61.59 69.4,65.41 71.13,67.13 J13.1
N$16
  Top 0.152: U12.16 143.65,28.27 143.95,28.57 R16.2
N$17
  Top 0.152: U12.15 144.75,27.29 | R17.2 145.01,27.6 145.22,27.81 146.49,27.81 146.71,28.03 R16.1
  Top 0.254: 144.75,27.29 R17.2
N$18
  Top 0.152: U11.16 70.73,8.44 70.52,8.23 R14.2
N$19
  Top 0.152: U11.15 69.62,9.54 | R14.1 67.69,8.83 67.88,9.02 69.28,9.02 69.4,9.14 69.4,9.77
  Top 0.254: 69.62,9.54 R15.2 69.4,9.77
N$20
  Top 0.254: JP4.2 116.05,25.36 116.27,25.15 116.27,23.88 116.48,23.66 R21.1
N$21
  Top 0.254: T1.2 C58.1
N$22
  Bottom 0.254: T2.2 C59.1
N$23
  Top 0.508: D1.2 R1.2
N$24
  Top 0.254: C48.2 134.54,40.91 134.81,40.64 U10.4
N$25
  Top 0.254: C49.1 134.54,39.61 134.94,40.01 U10.5
N$26
  Top 0.254: U10.6 135.19,39.37 134.81,38.99 134.81,38.35 134.56,38.1 C49.2
N$28
  pour Top (no thermals): 117.03,26.67 117.03,25.27 118.68,25.27 117.28,26.67
N$29
  Top 0.508: D2.2 R2.2
N$30
  Top 0.254: R22.2 116.48,28.41 116.27,28.19 116.27,26.8 116.14,26.67 115.54,26.67 JP6.1
N$32
  Top 0.508: D3.2 R3.2
PI_SHUTDOWN  (via drill 0.2)
  Top 0.254: A3.D14 86.55,34.04 90.11,30.48 97.6,30.48 99.25,32.13 121.09,32.13 124.01,35.05 v134.17,35.05
  Bottom 0.254: v134.17,35.05 166.69,35.05 J8.1
RESTORE  (via drill 0.35)
  Top 0.254: v89.6,28.96 A3.D9
  Bottom 0.254: J10.6 112.94,62.23 112.94,58.52 89.6,35.18 v89.6,28.96
RHEIGHT_N  (via drill 0.35)
  Top 0.254: D8.2 163.38,35.14 163.38,39.37 159.64,43.12 J7.3 157.82,43.12 149.63,34.92 139.81,34.92 135.57,30.69 135.57,25.27 135.06,24.77 134.05,24.77 132.9,25.91 130.87,25.91 130.15,25.18 JP5.2 129.01,26.29 U14.7 v126.55,26.29 | J2.3 39.43,35.63 D10.2 38.38,33.82 39.69,32.52 RH_N.1 44,31.88 44,28.57 41.46,26.04 38.29,26.04 37.08,27.24 J3.3
  Bottom 0.254: J3.3 31.58,27.24 42.06,16.76 119.91,16.76 126.55,23.41 v126.55,26.29
RHEIGHT_P  (via drill 0.35)
  Top 0.254: D8.1 162.15,32.35 160.08,34.42 J7.4 158.66,40.7 152.38,34.42 140.02,34.42 136.08,30.48 136.08,25.06 135.27,24.26 134.05,24.26 132.65,22.86 131,22.86 130.24,23.62 R20.1 128.75,25.02 U14.6 v125.92,25.02 | J2.4 40.13,43.12 37.27,40.26 D10.1 | D10.1 37.27,32.43 37.26,32.43 34.48,29.65 J3.4 | D10.1 38.42,33.06 39.33,32.16 39.33,30.07 RH_P.1
  Bottom 0.254: J3.4 31.3,28.23 42.27,17.27 119.7,17.27 125.92,23.5 v125.92,25.02
RL_EXT_N
  Top 0.254: J14.6 21.46,8.26 29.4,8.26 31.3,10.16 31.3,10.41 T1.4
RL_EXT_P
  Top 0.254: J14.5 17.78,7.75 29.4,7.75 31.18,5.97 T1.6
RL_N  (via drill 0.35)
  Top 0.152: v66.23,12.42 66.65,12 70.69,12 U11.10
  Top 0.254: T1.3 42.61,11.81 RL_IM.1
  Bottom 0.152: R18.1 46.03,8.85 46.68,8.2 61.1,8.2 65.32,12.42 v66.23,12.42
  Bottom 0.254: T1.3 43.62,8.26 44.68,8.26 R18.1
RL_P  (via drill 0.35)
  Top 0.152: v66.23,11.18 66.65,11.6 70.68,11.6 U11.11
  Top 0.254: T1.1 42.61,4.19 RL_IP.1
  Bottom 0.152: R18.2 46.03,7.15 46.68,7.8 61.27,7.8 64.65,11.18 v66.23,11.18
  Bottom 0.254: T1.1 43.62,7.75 44.68,7.75 R18.2
RR_EXT_N
  Top 0.254: J16.6 178.73,14.54 172.06,7.87 170.12,7.87 168.34,6.1 T2.4
RR_EXT_P
  Top 0.254: J16.5 178.37,14.9 171.94,8.47 170.16,8.47 168.34,10.29 T2.6
RR_N
  Top 0.152: R19.1 152.85,7.28 152.2,7.92 151.15,7.92 150.28,8.8 150.28,24.13 149.62,24.79 U12.10
  Top 0.254: R19.1 153.73,7.28 | 153.73,7.28 154.56,7.28 155.16,7.87 156.4,7.87 158.18,6.1 T2.3 | RR_IM.1 153.73,7.28
RR_P
  Top 0.152: R19.2 152.85,8.98 152.2,8.33 151.32,8.33 150.68,8.97 150.68,24.35 149.75,25.29 U12.11
  Top 0.254: R19.2 153.73,8.98 | 153.73,8.98 154.56,8.98 155.16,8.38 156.4,8.38 158.18,10.16 T2.1 | RR_IP.1 153.73,8.98
RX_232
  Top 0.254: U10.9 139.97,38.1 134.89,33.02 124.73,33.02 122.7,30.99 104.92,30.99 98.87,24.94 A3.D7
RX_485  (via drill 0.2)
  Top 0.254: A3.D16 85.53,28.96 89.6,24.89 95.48,24.89 99.04,21.34 100.9,21.34 v101.41,21.84 | v120.84,25.4 120.84,26.04 122.36,27.56 U14.1
  Bottom 0.254: v120.84,25.4 120.84,24.21 117.84,21.21 103.82,21.21 103.19,21.84 v101.41,21.84
RXD_232
  Top 0.254: RXD.1 132.27,67.31 129.6,69.98 120.69,69.98 J10.2 119.57,65.41 121.47,65.41 122.11,64.77 122.11,62.87 122.74,62.23 124.01,62.23 124.63,61.61 D7.2 124.63,57.16 138.37,43.43 138.37,38.44 137.39,37.47 136.59,37.47 U10.8
SHDN_K  (via drill 1)
  Top 0.813: J12.4 v91.43,69.85
  Bottom 0.813: v91.43,69.85 66.23,69.85 61.53,65.15 50.48,65.15 43.37,58.04 43.37,53.09 32.57,42.29 32.57,38.73 21.84,28 21.84,19.73 19.37,17.26 J14.7
SHDN_L
  Bottom 0.813: J16.7 181.86,12.06 175.16,12.06 172.24,14.99 23.11,14.99 J14.8
SHDN_M
  Bottom 0.813: J12.5 100.14,62.87 101.03,61.98 104.08,61.98 104.96,62.87 104.96,66.04 108.77,69.85 134.17,69.85 138.75,65.28 148.91,65.28 156.4,57.78 156.4,52.7 168.15,40.96 168.15,37.78 174.18,31.75 174.18,29.59 183.83,19.94 183.83,17.59 J16.2
SYNC_IN  (via drill 0.35)
  Top 0.254: v90.87,21.34 A3.D6
  Bottom 0.254: J10.7 114.08,60.38 114.08,57.63 90.87,34.41 v90.87,21.34
SYNC_OUT  (via drill 0.35)
  Top 0.254: v92.14,20.07 97.6,20.07 A3.D5
  Bottom 0.254: J10.4 122.62,65.91 120.71,65.91 119.32,64.52 119.32,62.61 114.97,58.27 114.97,56.53 92.14,33.69 v92.14,20.07
TEENSY_CAN_RX1
  Top 0.254: A3.D0 95.31,7.62 101.15,13.46 101.15,15.24 108.33,22.42 U13.4
TEENSY_CAN_TX1
  Top 0.254: U13.1 108.77,27.94 109.41,27.3 109.41,22.48 102.3,15.37 102.3,12.95 98.87,9.53 A3.D1
TEENSY_CLK  (via drill 0.35)
  Top 0.152: A3.D13 80.07,34.52 78.41,32.85 78.41,13.12 75.83,10.54 U11.4 | v129.73,44.45 CLK.1 | U12.4 140.4,26.29 141.79,27.68 141.79,30.48 141.79,31.04 v140.19,32.64
  Top 0.254: A3.D13 90.36,36.58 91.88,38.1 100.01,38.1 103.44,34.67 114.62,34.67 115.76,35.81 115.76,39.6 117.43,41.27 U15.13 123.38,41.27 126.55,44.45 CLK.1
  Bottom 0.152: v129.73,44.45 131,43.18 131,35.56 134.51,32.05 138.29,32.05 138.87,32.64 v140.19,32.64
TEENSY_SDI  (via drill 0.35)
  Top 0.152: 137.83,26.79 U12.3 140.33,26.79 141.16,27.62 141.16,30.4 v140.29,31.27 | v86.55,21.59 86.55,14.61 81.94,9.99 R12.1 76.47,10.04 U11.3 | v87.82,35.56 94.44,35.56 95.44,36.56 95.44,36.58 | v129.73,40.64 MISO.1
  Top 0.254: 137.83,26.79 R13.1 | MISO.1 125.09,40.64 124.46,40.01 U15.12 117.66,40.01 116.39,38.73 116.39,35.56 114.87,34.04 103.23,34.04 100.69,36.58 95.44,36.58 A3.D12
  Bottom 0.152: v86.55,21.59 86.55,34.29 v87.82,35.56 | v140.29,31.27 134.02,31.27 130.36,34.92 130.36,40.01 v129.73,40.64
TEENSY_SDO  (via drill 0.35)
  Top 0.152: v87.82,21.59 87.82,15.24 81.92,9.34 76.03,9.34 75.83,9.54 U11.2 | v88.61,34.77 96.86,34.77 97.6,34.04 A3.D11 | U12.2 140.25,27.29 140.52,27.56 140.52,29.72 v140.27,29.97 | v129.69,36.83 MOSI.1
  Top 0.254: MOSI.1 124.01,36.83 122.11,38.73 U15.11 117.79,38.73 117.03,37.97 117.03,35.31 115.12,33.4 100.14,33.4 99.5,34.04 A3.D11
  Bottom 0.152: v87.82,21.59 87.82,33.99 v88.61,34.77 | v140.27,29.97 139,29.97 138.49,30.48 134.17,30.48 129.69,34.96 v129.69,36.83
THERM1  (via drill 0.2, 0.35)
  Top 0.254: J6.8 146.3,48.9 R4.2 v139.72,47.62 | v131.6,47.62 117.54,47.62 115.76,45.85 110.06,45.85 C8.1 110,44.38 112.77,44.38 113.54,45.15 U15.1
  Bottom 0.254: v131.6,47.62 v139.72,47.62
THERM2  (via drill 0.2, 0.35)
  Top 0.254: J6.7 145.29,52.07 R5.2 v139.72,50.93 v139.73,50.92 | v129.98,48.26 116.78,48.26 114.94,46.42 105.54,46.42 104.85,45.73 C9.1 104.85,44.45 105.48,43.81 U15.2
  Bottom 0.254: v139.73,50.92 133.77,50.92 131.11,48.26 v129.98,48.26
THERM3  (via drill 0.2, 0.35)
  Top 0.254: J6.6 144.27,55.24 R6.2 v139.72,54.1 | v128.46,48.9 116.31,48.9 114.41,46.99 105.22,46.99 103.82,45.59 103.82,43.45 104.72,42.55 C10.1 105.55,43.25 112.79,43.25 113.5,42.55 U15.3
  Bottom 0.254: v128.46,48.9 129.52,48.9 134.68,54.06 139.67,54.06 v139.72,54.1
THERM4  (via drill 0.2, 0.35)
  Top 0.254: J6.5 143.25,58.42 R7.2 139.76,58.38 v139.76,57.15 | U15.4 113.24,41.27 112.99,41.53 110.31,41.53 C11.1 108.62,42.55 107.67,41.59 104.17,41.59 103.19,42.57 103.19,45.93 104.75,47.5 113.73,47.5 115.76,49.53 124.27,49.53 124.9,50.16 126.13,50.16 v126.77,49.53
  Bottom 0.254: v139.76,57.15 135.55,57.15 127.93,49.53 v126.77,49.53
THERM5  (via drill 0.35)
  Top 0.254: R8.2 56.26,58.42 J1.8 | v89.22,42.93 90.36,42.93 90.99,42.29 101.41,42.29 102.81,40.89 107.76,40.89 108.65,40 108.66,40.01 C12.1 110.18,40.89 112.61,40.89 113.5,40.01 U15.5
  Bottom 0.254: J1.8 53.91,51.94 63.56,42.29 85.91,42.29 86.55,42.93 v89.22,42.93
THERM6  (via drill 0.35)
  Top 0.254: R9.2 55.24,55.24 J1.7 | v89.22,41.56 100.52,41.56 102.07,40.01 C13.1 105.74,39.12 113.16,39.12 U15.6
  Bottom 0.254: J1.7 52.13,52.45 63.05,41.53 89.19,41.53 v89.22,41.56
THERM7  (via drill 0.35)
  Top 0.254: R10.2 54.23,52.07 J1.6 | v90.43,40.82 99.7,40.82 102.17,38.35 108.41,38.35 C14.1 110.18,36.58 112.61,36.58 113.5,37.47 U15.7
  Bottom 0.254: J1.6 50.35,52.96 62.49,40.82 v90.43,40.82
THERM8  (via drill 0.35)
  Top 0.254: R11.2 53.21,48.9 J1.5 | v90.36,39.5 92.39,39.5 92.9,40.01 99.25,40.01 101.79,37.47 C15.1 106.3,36.01 113.12,36.01 113.3,36.2 U15.8
  Bottom 0.254: J1.5 62.61,39.5 v90.36,39.5
TX_232
  Top 0.254: U10.11 140.4,39.37 134.68,33.66 124.01,33.66 121.98,31.62 104.84,31.62 99.63,26.42 A3.D8
TX_485  (via drill 0.2)
  Top 0.254: A3.D17 86.17,26.42 88.2,24.38 95.27,24.38 99.16,20.49 v101.36,20.49 | v121.22,22.79 122.18,23.75 U14.4
  Bottom 0.254: v101.36,20.49 102,20.49 102.51,19.98 118.42,19.98 v121.22,22.79
TXD_232
  Top 0.254: TXD.1 132.27,63.5 131,64.77 131,66.04 128.21,68.83 122.54,68.83 J10.3 122.74,65.23 122.74,63.5 123.38,62.87 124.65,62.87 125.93,61.58 D7.1 125.93,57.13 139.51,43.56 139.51,41.53 140.4,40.64 U10.13

## Text on the board
tPlace: HyTech Racing 2024 / Sensor Acquisition Board / Rear rev5 / Designed by Cecilia Yang